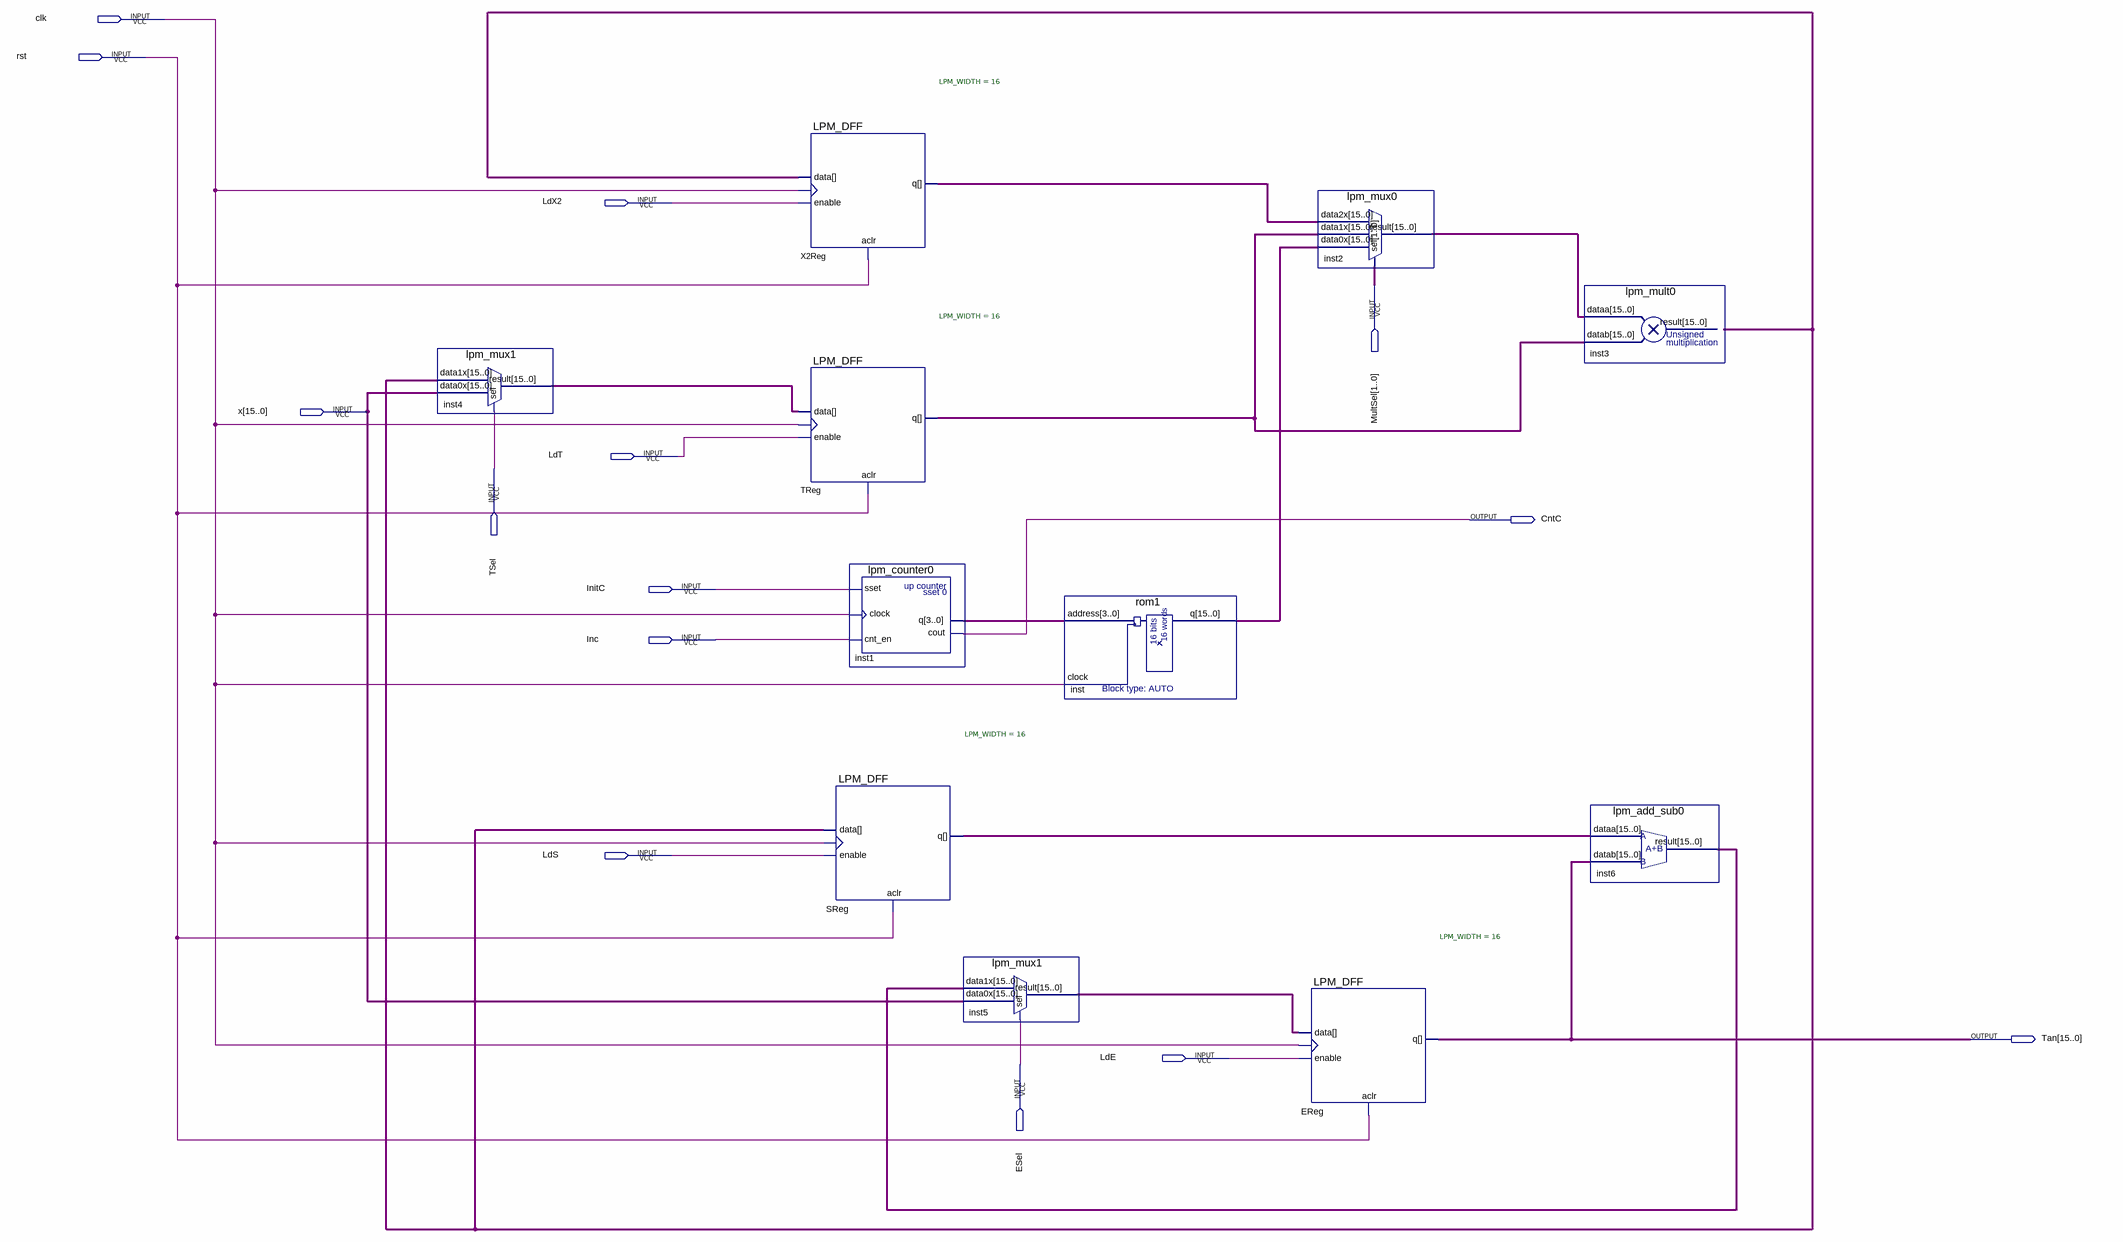
[diagram p0: schematic sheet]
// Quartus schematic tanDp.bdf as structural Verilog: 11 symbols, 14 pins
module tanDp (
  input  clk,
  input  rst,
  input  LdX2,
  input  [1:0] MultSel,
  input  [15:0] x,
  input  LdT,
  input  TSel,
  input  InitC,
  input  Inc,
  input  LdS,
  input  LdE,
  input  ESel,
  output CntC,
  output [15:0] Tan
);

  wire [3:0] inst1_q;
  wire [15:0] inst2_result, inst3_result, inst4_result, inst5_result, inst6_result, inst_q, SReg_q, TReg_q,
       X2Reg_q;

  lpm_mux1 inst4 (.data1x(inst3_result), .data0x(x), .sel(TSel), .result(inst4_result));
  LPM_DFF #(.LPM_WIDTH(16)) X2Reg (.aclr(rst), .clock(clk), .data(inst3_result), .enable(LdX2), .q(X2Reg_q));
  LPM_DFF #(.LPM_WIDTH(16)) TReg (.aclr(rst), .clock(clk), .data(inst4_result), .enable(LdT), .q(TReg_q));
  lpm_counter0 inst1 (.sset(InitC), .clock(clk), .cnt_en(Inc), .cout(CntC), .q(inst1_q));
  LPM_DFF #(.LPM_WIDTH(16)) SReg (.aclr(rst), .clock(clk), .data(inst3_result), .enable(LdS), .q(SReg_q));
  lpm_mux1 inst5 (.data1x(inst6_result), .data0x(x), .sel(ESel), .result(inst5_result));
  rom1 inst (.address(inst1_q), .clock(clk), .q(inst_q));
  LPM_DFF #(.LPM_WIDTH(16)) EReg (.aclr(rst), .clock(clk), .data(inst5_result), .enable(LdE), .q(Tan));
  lpm_mux0 inst2 (.data2x(X2Reg_q), .data1x(TReg_q), .data0x(inst_q), .sel(MultSel), .result(inst2_result));
  lpm_mult0 inst3 (.dataa(inst2_result), .datab(TReg_q), .result(inst3_result));
  lpm_add_sub0 inst6 (.dataa(SReg_q), .datab(Tan), .result(inst6_result));
endmodule
